# EAGLE design Adafruit 2.9in eInk FeatherWing (EAGLE 9.6.2)
COMPANY: ADAFRUIT INDUSTRIES; DRAWN: K. TOWNSEND; REV: A
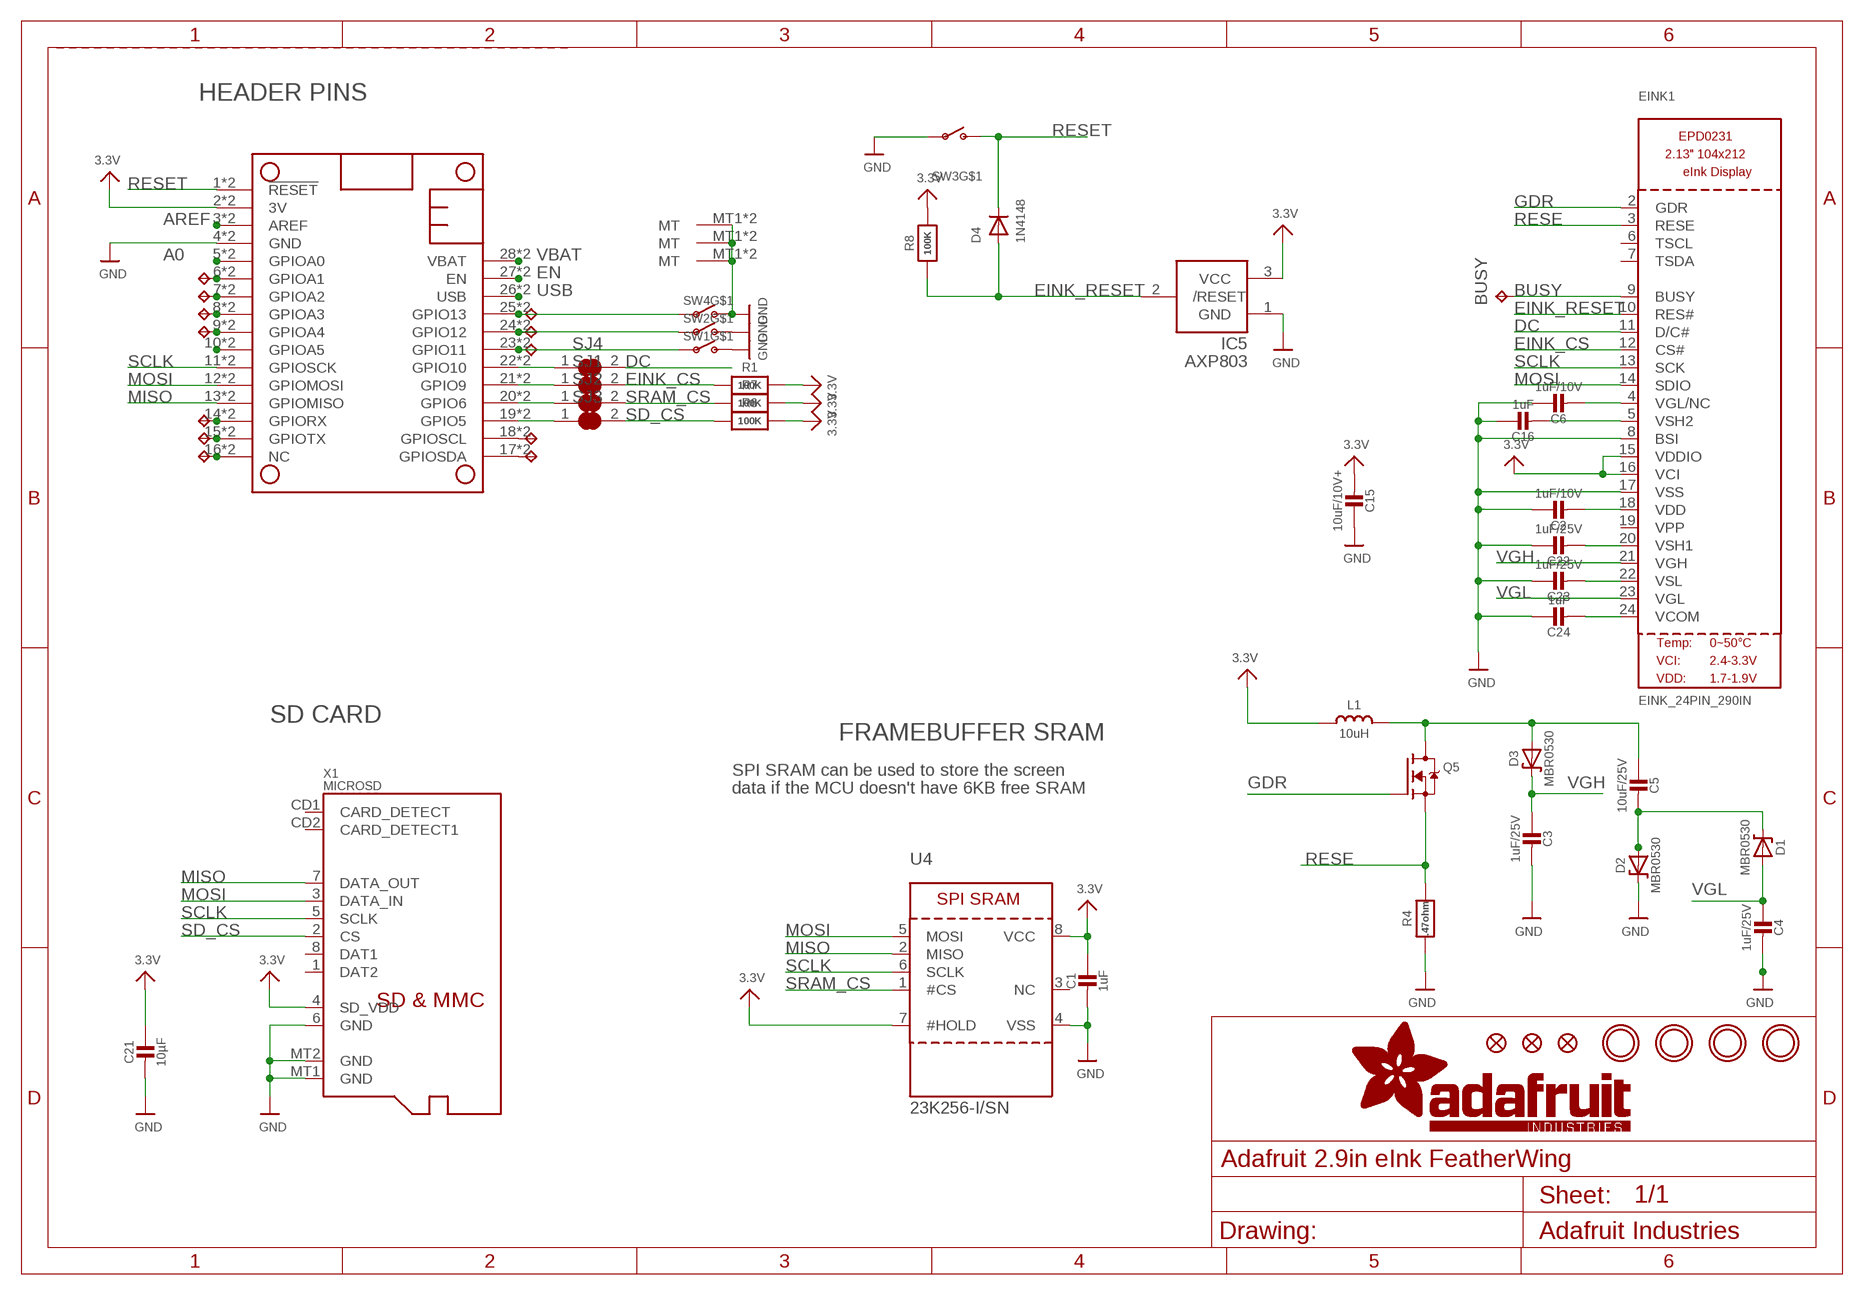
[diagram p0: schematic, sheet 1]

## Parts
BUSY  TPTP15SQ  [TP15SQ]
C1  1uF  CAP_CERAMIC0805_10MGAP  [0805_10MGAP]
C2  1uF/10V  CAP_CERAMIC0805-NOOUTLINE  [0805-NO]
C3  1uF/25V  CAP_CERAMIC0805-NOOUTLINE  [0805-NO]
C4  1uF/25V  CAP_CERAMIC0805-NOOUTLINE  [0805-NO]
C5  10uF/25V  CAP_CERAMIC0805-NOOUTLINE  [0805-NO]
C6  1uF/10V  CAP_CERAMIC0805-NOOUTLINE  [0805-NO]
C15  10uF/10V+  CAP_CERAMIC0805-NOOUTLINE  [0805-NO]
C16  1uF  CAP_CERAMIC0805-NOOUTLINE  [0805-NO]
C21  10µF  CAP_CERAMIC0805-NOOUTLINE  [0805-NO]
C22  1uF/25V  CAP_CERAMIC0805-NOOUTLINE  [0805-NO]
C23  1uF/25V  CAP_CERAMIC0805-NOOUTLINE  [0805-NO]
C24  1uF  CAP_CERAMIC0805-NOOUTLINE  [0805-NO]
D1  MBR0530  DIODE-SCHOTTKYSOD-123  [SOD-123]
D2  MBR0530  DIODE-SCHOTTKYSOD-123  [SOD-123]
D3  MBR0530  DIODE-SCHOTTKYSOD-123  [SOD-123]
D4  1N4148  DIODESOD-323F  [SOD-323F]
EINK1  EINK_24PIN_290IN  [EINK_290IN]
FID1  FIDUCIAL_1MM  [FIDUCIAL_1MM]
FID2  FIDUCIAL_1MM  [FIDUCIAL_1MM]
FID3  FIDUCIAL_1MM  [FIDUCIAL_1MM]
IC5  AXP803  AXP083-SAG  [SOT23]
L1  10uH  INDUCTORNR401  [INDUCTOR_4X4MM_NR401]
MS1  FEATHERWING_SMTDUALNOHOLES  [FEATHERWING_SMT_NOHOLES]
Q5  IRLML0100  IRLML2060TRPBF  [SOT23-3]
R1  100K  RESISTOR_0603_NOOUT  [0603-NO]
R4  .47ohm  RESISTOR0805_10MGAP  [0805_10MGAP]
R6  100K  RESISTOR_0603_NOOUT  [0603-NO]
R7  100K  RESISTOR_0603_NOOUT  [0603-NO]
R8  100K  RESISTOR_0603_NOOUT  [0603-NO]
SJ1  SOLDERJUMPER_CLOSED  [SOLDERJUMPER_CLOSEDWIRE]
SJ2  SOLDERJUMPER_CLOSED  [SOLDERJUMPER_CLOSEDWIRE]
SJ3  SOLDERJUMPER_CLOSED  [SOLDERJUMPER_CLOSEDWIRE]
SJ4  SOLDERJUMPER_CLOSED  [SOLDERJUMPER_CLOSEDWIRE]
SW1  SWITCH_SPST_TACT_RA  [SPST_TACTILE_RA]
SW2  SWITCH_SPST_TACT_RA  [SPST_TACTILE_RA]
SW3  SWITCH_SPST_TACT_RA  [SPST_TACTILE_RA]
SW4  SWITCH_SPST_TACT_RA  [SPST_TACTILE_RA]
TP1  TPTP15SQ  [TP15SQ]
TP2  TPTP15SQ  [TP15SQ]
TP3  TPTP15SQ  [TP15SQ]
TP4  TPTP15SQ  [TP15SQ]
TP5  TPTP15SQ  [TP15SQ]
TP6  TPTP15SQ  [TP15SQ]
TP7  TPTP15SQ  [TP15SQ]
TP8  TPTP15SQ  [TP15SQ]
TP9  TPTP15SQ  [TP15SQ]
TP11  TPTP15SQ  [TP15SQ]
TP12  TPTP15SQ  [TP15SQ]
TP13  TPTP15SQ  [TP15SQ]
U4  23K256-I/SN  SRAM_SPI_SOIC8  [SOIC8_150MIL]
U$3  MOUNTINGHOLE2.5  [MOUNTINGHOLE_2.5_PLATED]
U$4  MOUNTINGHOLE2.5  [MOUNTINGHOLE_2.5_PLATED]
U$5  MOUNTINGHOLE2.5  [MOUNTINGHOLE_2.5_PLATED]
U$6  MOUNTINGHOLE2.5  [MOUNTINGHOLE_2.5_PLATED]
X1  MICROSD  [MICROSD]

## Nets
3.3V: C1.1 C15.2 C21.1 EINK1.15(VDDIO) EINK1.16(VCI) IC5.3(VCC) L1.P$2 MS1.2(3V) MS1.2B(3V) R1.2 R6.2 R7.2 R8.2 U4.7(#HOLD) U4.8(VCC) X1.4(SD_VDD)
A0: MS1.5(GPIOA0) MS1.5B(GPIOA0)
AREF: MS1.3(AREF) MS1.3B(AREF)
BUSY: BUSY.TP EINK1.9(BUSY)
DC: EINK1.11(D/C#) SJ4.2
EINK_CS: EINK1.12(CS#) R1.1 SJ1.2
EINK_RESET: D4.A EINK1.10(RES#) IC5.2(/RESET) R8.1
EN: MS1.27(EN) MS1.27B(EN)
GDR: EINK1.2(GDR) Q5.1(G)
GND: C1.2 C2.1 C3.2 C4.2 C6.1 C15.1 C16.1 C21.2 C22.1 C23.1 C24.1 D2.C EINK1.8(BSI) EINK1.17(VSS) IC5.1(GND) MS1.4(GND) MS1.4B(GND) R4.2 SW1.2(S) SW1.MT1(MT) SW1.MT2(MT) SW2.2(S) SW2.MT1(MT) SW2.MT2(MT) SW3.1(P) SW4.2(S) SW4.MT1(MT) SW4.MT2(MT) U4.4(VSS) X1.6(GND) X1.MT1(GND) X1.MT2(GND)
H: MS1.19(GPIO5) MS1.19B(GPIO5) SJ3.1
I: MS1.20(GPIO6) MS1.20B(GPIO6) SJ2.1
J: MS1.21(GPIO9) MS1.21B(GPIO9) SJ1.1
K: MS1.22(GPIO10) MS1.22B(GPIO10) SJ4.1
MISO: MS1.13(GPIOMISO) MS1.13B(GPIOMISO) U4.2(MISO) X1.7(DATA_OUT)
MOSI: EINK1.14(SDIO) MS1.12(GPIOMOSI) MS1.12B(GPIOMOSI) U4.5(MOSI) X1.3(DATA_IN)
N$1: MS1.10(GPIOA5) MS1.10B(GPIOA5)
N$2: C5.2 D1.C D2.A
N$3: C5.1 D3.A L1.P$1 Q5.3(D)
N$4: C16.2 EINK1.5(VSH2)
N$5: C2.2 EINK1.18(VDD)
N$6: C22.2 EINK1.20(VSH1)
N$8: MS1.6(GPIOA1) MS1.6B(GPIOA1) TP6.TP
N$9: C6.2 EINK1.4(VGL/NC)
N$10: MS1.7(GPIOA2) MS1.7B(GPIOA2) TP7.TP
N$11: MS1.8(GPIOA3) MS1.8B(GPIOA3) TP8.TP
N$12: MS1.9(GPIOA4) MS1.9B(GPIOA4) TP9.TP
N$14: MS1.14(GPIORX) MS1.14B(GPIORX) TP11.TP
N$15: MS1.15(GPIOTX) MS1.15B(GPIOTX) TP12.TP
N$16: MS1.16(NC) MS1.16B(NC) TP13.TP
N$17: MS1.17(GPIOSDA) MS1.17B(GPIOSDA) TP4.TP
N$18: MS1.18(GPIOSCL) MS1.18B(GPIOSCL) TP3.TP
N$19: MS1.23(GPIO11) MS1.23B(GPIO11) SW1.1(P) TP1.TP
N$20: MS1.24(GPIO12) MS1.24B(GPIO12) SW2.1(P) TP2.TP
N$21: MS1.25(GPIO13) MS1.25B(GPIO13) SW4.1(P) TP5.TP
N$27: C23.2 EINK1.22(VSL)
N$33: C24.2 EINK1.24(VCOM)
RESE: EINK1.3(RESE) Q5.2(S) R4.1
RESET: D4.C MS1.1(!RESET) MS1.1B(!RESET) SW3.2(S)
SCLK: EINK1.13(SCK) MS1.11(GPIOSCK) MS1.11B(GPIOSCK) U4.6(SCLK) X1.5(SCLK)
SD_CS: R6.1 SJ3.2 X1.2(CS)
SRAM_CS: R7.1 SJ2.2 U4.1(#CS)
USB: MS1.26(USB) MS1.26B(USB)
VBAT: MS1.28(VBAT) MS1.28B(VBAT)
VGH: C3.1 D3.C EINK1.21(VGH)
VGL: C4.1 D1.A EINK1.23(VGL)
Unconnected: EINK1.6(TSCL) EINK1.7(TSDA) EINK1.19(VPP) SW3.MT1(MT) SW3.MT2(MT) U4.3(NC) X1.1(DAT2) X1.8(DAT1) X1.CD1(CARD_DETECT) X1.CD2(CARD_DETECT1)

## Notes on the sheet
- HEADER PINS
- SD CARD
- FRAMEBUFFER SRAM
- SPI SRAM can be used to store the screen
- data if the MCU doesn't have 6KB free SRAM

## Library data of the parts
BUSY TP1-TP9 TP11-TP13 = testpad:TP: Test pad
C1 = microbuilder:CAP_CERAMIC: Ceramic Capacitors For new designs, use the packages preceded by an '_' character since they are more reliable: The following footprints should be used on most boards: _0402 - Standard footprint for regular board layouts _0603 - Standard footprint for regular board layouts _0805 - Standard footprint for regular board layouts _1206 - Standard footprint for regular board layouts For extremely tight-pitch boards where space is at a premium, the following 'micro-pitch' footprints can be used (smaller pads, no silkscreen outline, etc.): _0402MP - Micro-pitch footprint for very dense/compact boards _0603MP - Micro-pitch footprint for very dense/compact boards _0805MP - Micro-pitch footprint for very dense/compact boards _1206MP - Micro-pitch footprint for very dense/compact boards; REV: A
C2-C6 C15 C16 C21-C24 = microbuilder:CAP_CERAMIC: Ceramic Capacitors For new designs, use the packages preceded by an '_' character since they are more reliable: The following footprints should be used on most boards: _0402 - Standard footprint for regular board layouts _0603 - Standard footprint for regular board layouts _0805 - Standard footprint for regular board layouts _1206 - Standard footprint for regular board layouts For extremely tight-pitch boards where space is at a premium, the following 'micro-pitch' footprints can be used (smaller pads, no silkscreen outline, etc.): _0402MP - Micro-pitch footprint for very dense/compact boards _0603MP - Micro-pitch footprint for very dense/compact boards _0805MP - Micro-pitch footprint for very dense/compact boards _1206MP - Micro-pitch footprint for very dense/compact boards
D1-D3 = microbuilder:DIODE-SCHOTTKY
D4 = adafruit:DIODE: Diode SMADIODE - SMA Surface Mount Package 20V 1A Schottky Diode Digikey: 641-1014-6-ND DO-1N4148 - Through Hole Small Current Diode SOD-123 20V 1 A (.5mV Vf) Schottky Diode - Digikey: MBRX120TPMSCT-ND SOD-323 10V 570mA (.38mV Vf, 3ns) Schottky Diode - Digikey: ZLLS410CT-ND SOD-523 30V 30mA Schottky Diode (RB751S-40TE61) - Digikey: RB751S-40TE61CT-ND SOT23-R/W - SOT23 Package (R = Solder Paste/Reflow Ovens, W = Hand-Soldering) BAT54Film 40V 300mA - Digikey: 497-7162-1-ND
EINK1 = adafruit_display:EINK_24PIN
FID1-FID3 = microbuilder:FIDUCIAL: Fiducial Alignment Points Various fiducial points for machine vision alignment.; BOM: EXCLUDE
IC5 = adafruit:AXP083
L1 = microbuilder:INDUCTOR: Inductors 0603: 10nH Ceramic Inductor - microwire antenna/RF (Digikey: 712-1434-2-ND) 0805: 560nH Ceramic Inductor - RF (Digikey: 553-1047-1-ND) 270nH Ceramic Inductor - Q = 40@250MHz, +-5%, 1 Ohm DC Resistance (Digikey: 535-10506-2-ND) 1007 (2518 Metric) SMT: 10µH 10% 250mOhm 820mA 1007 Inductor (Digikey: 587-2189-1-ND) 22µH 10% 500mOhm 580mA 1007 Inductor (Digikey: 587-2190-1-ND) 47µH 10% 950mOhm 420mA 1007 Inductor (Digikey: 587-2191-1-ND) 47µH 5% 100mOhm 1A 1008 Inductor (Digikey: 732-1816-1-ND) 5.0x5.0mm (Taiyo Yuden NR5040 Series) 6.8µH 20% 2.3A 64mOhm Inductor (Digikey: 587-2374-2-ND) 5.0x5.0mm (TDK VLC5045 Series) 4.7µH 20% 3.3A 34mOhm Inductor (Digikey: 445-6526-1-ND) 6.8µH 20% 2.7A 46mOhm Inductor (Digikey: 445-6527-1-ND) 6.0x6.0mm (TDK VLC6045 Series) 4.7µH 20% 3.8A 27mOhm Inductor (Digikey: 445-6538-2-ND) 6.8µH 20% 3A 41mOhm Inductor (Digikey: 445-6540-1-ND) 6.2µH 30% 2.2A 45mOhm Inductor (Digikey: SRR5028-6R2YCT-ND) - Not TDK VLC6045 but footprint should match 6.0x6.0mm (TDK SLF6045 Series) 6.8uH 30% 2A 33mOhm Inductor (Digikey: 445-4572-1-ND, Mouser: 810-SLF645T6R8N2R0PF) 6.0x6.0mm (Sumida CDRH5D28 Series) 6.2uH 30% 1.8A 45mOhm Inductor (Digikey: 308-1542-1-ND) Taiyo Yuden NR3015T2R2M - 2.2uH 20% 1.5A (Digikey: 587-1648-2-ND, Mouser: 963-NR3015T2R2M) - Used with TI TPS62172 CoilCraft RFID Transponder Coil - MA5532-AE (For use with AS3935 Lightning Sensor) Taiyo Yuden NRH2412T2R2MNGH - 2.2uH 20% 1AA (Digikey: 587-3443-1-ND) - Used with TI LM3671 Vishay IHLP 1.0uH Molded Inductor - 24mOhm DCR, 5A, +/-20%, -55°C-125°C (Digikey: 541-1319-1-ND)
MS1 = microbuilder:FEATHERWING
Q5 = Parts:IRLML2060TRPBF
R1 R4 R6-R8 = microbuilder:RESISTOR: Resistors For new designs, use the packages preceded by an '_' character since they are more reliable: The following footprints should be used on most boards: _0402 - Standard footprint for regular board layouts _0603 - Standard footprint for regular board layouts _0805 - Standard footprint for regular board layouts _1206 - Standard footprint for regular board layouts For extremely tight-pitch boards where space is at a premium, the following 'micro-pitch' footprints can be used (smaller pads, no silkscreen outline, etc.): _0402MP - Micro-pitch footprint for very dense/compact boards _0603MP - Micro-pitch footprint for very dense/compact boards _0805MP - Micro-pitch footprint for very dense/compact boards _1206MP - Micro-pitch footprint for very dense/compact boards
SJ1-SJ4 = microbuilder:SOLDERJUMPER_CLOSED: Solder Jumper - Closed These solder jumpers are closed by default CLOSEDWIRE - 10 mil trace between pads that can be cut and resoldered later CLOSEDPERM - 63 mil trace between pads for a permanent connection (used to 'bridge' two signals, a shameless hack for Eagle). Can double as a test point as well (no cream layer)
SW1-SW4 = microbuilder:SWITCH_SPST: Switch - SPST 4UCon 19192 (6.7x2.6mm SMT)
U4 = microbuilder:SRAM_SPI_SOIC8: SRAM - 8-Pin SPI Interface 23K640-I/SN - 8KB (64Kb), 20MHz, 2.7-3.6V 23K256-I/SN - 32KB (256Kb), 20MHz, 2.7-3.6V 23LC512-I/SN - 64KB (512Kb), 20MHz, 2.7-3.6V
U$3-U$6 = microbuilder:MOUNTINGHOLE: Mounting Hole For #2 screws (0.086"/2.18mm width, 0.094"/2.4mm hole) use 2.5mm; BOM: EXCLUDE
X1 = microbuilder:MICROSD: MicroSD/Transflash Card Holder with SPI pinout 3M: 2908-05WB-MG 4UConnector: 19656 Footprint courtesy: Adafruit Industries

## Board
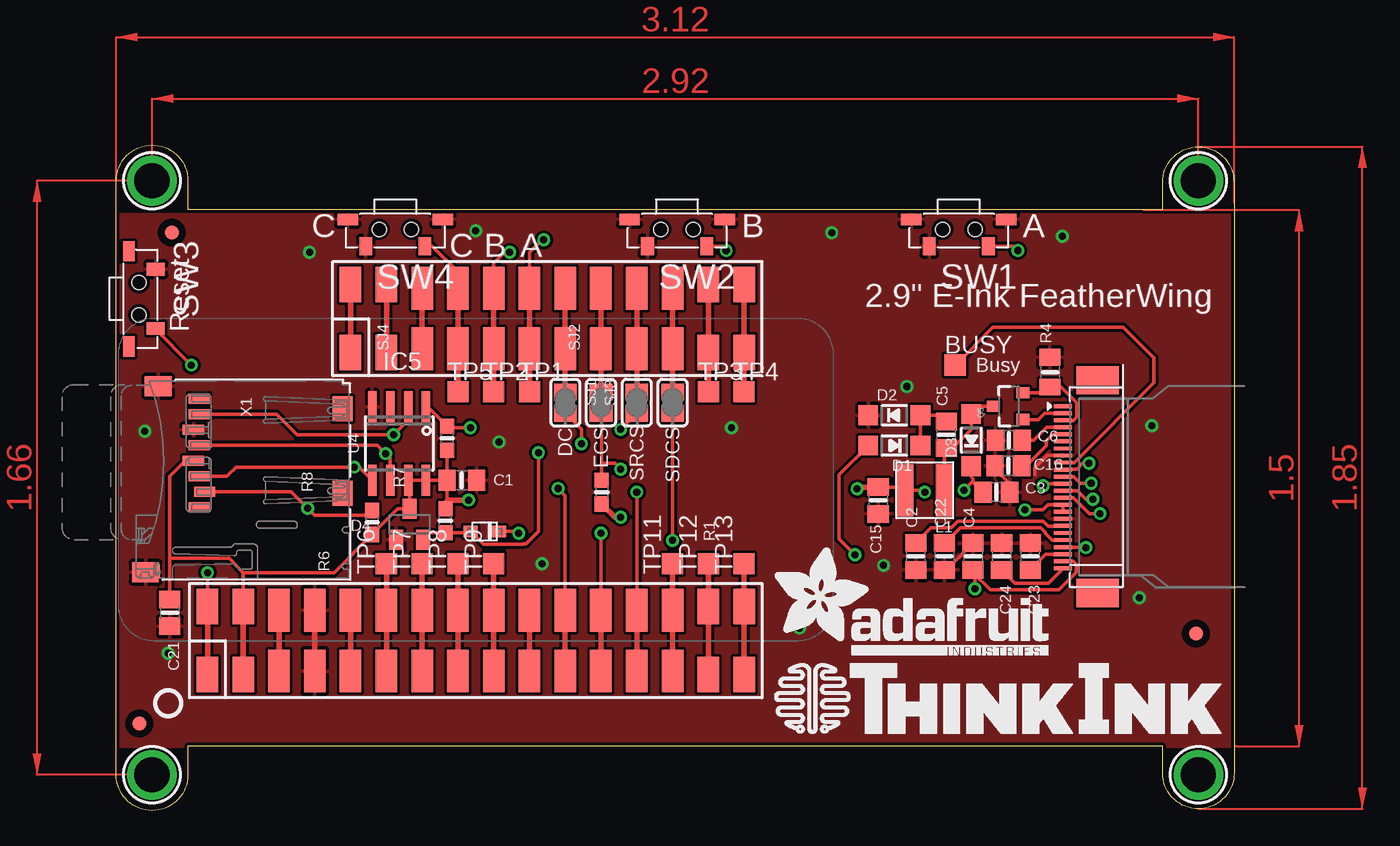
[diagram p1: board, top side]
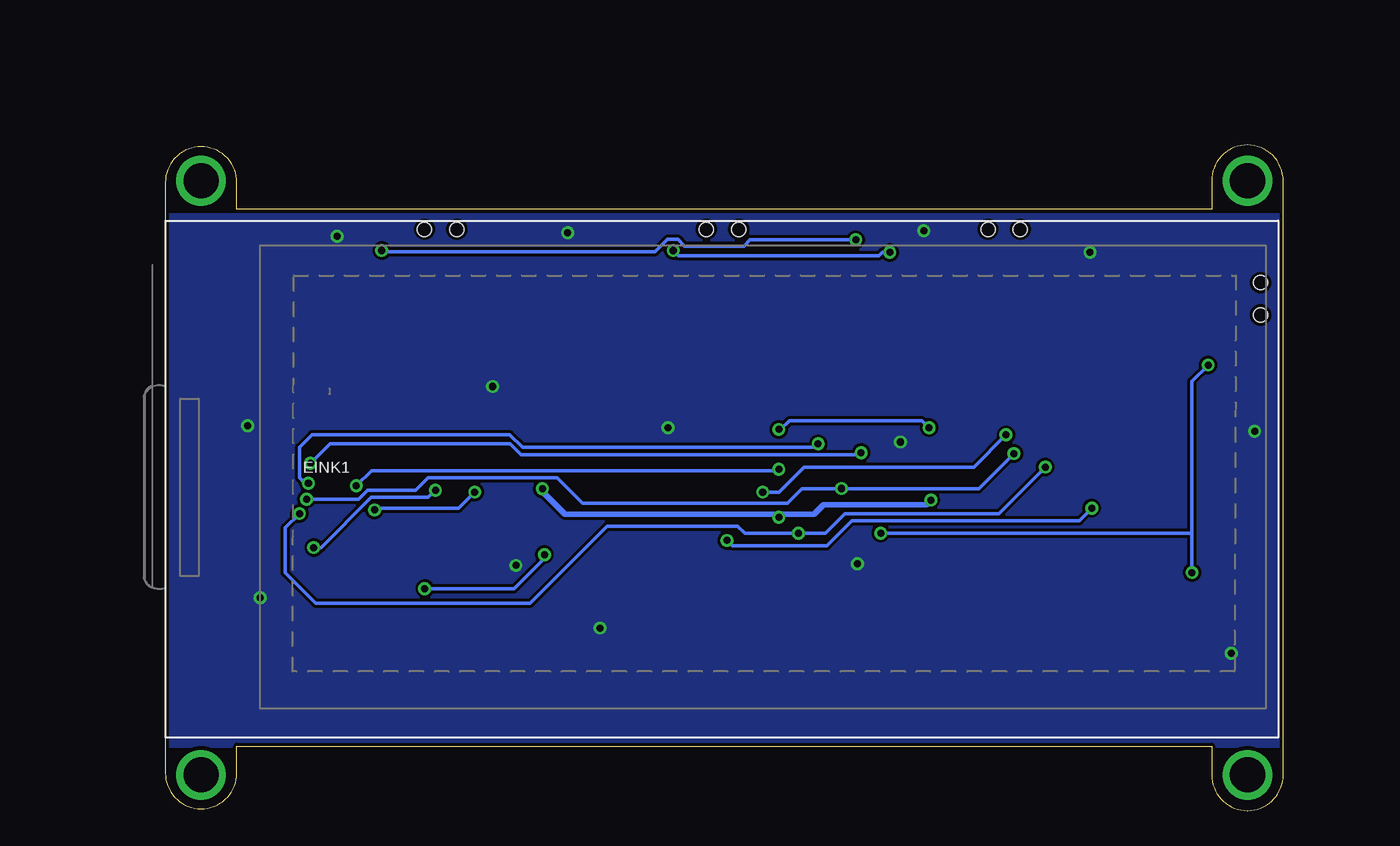
[diagram p2: board, bottom side, seen from below]

Size 79.38 x 47.24 mm. Coordinates in mm from the lower left corner, seen from the top.
Outline: 76.83,0.13 arc-90 74.3,2.67 74.3,4.57 5.08,4.57 5.08,2.54 arc-90 2.54,0 2.53,0 arc-90 0,2.54 0,44.7 arc-90 2.54,47.24 2.54,47.24 arc-90 5.08,44.7 5.08,42.67 74.3,42.67 74.3,44.58 arc-90 76.83,47.12 arc-90 79.38,44.58 79.38,2.67 arc-90 76.83,0.13
Copper layers (1*16): Top 0.035mm / dielectric 1.5mm / Bottom 0.035mm
Design rules "adafruit *": minimum track width 8mil, minimum drill 15.5mil, track to track 8mil, track to pad 8mil, pad to pad 8mil, via to via 8mil, smd to smd 8mil, copper to edge 10mil, drill to drill 8mil, minimum pad ring 10mil, minimum via ring 8mil, stop-mask expansion 2mil, vias tented up to drill 20mil, thermal gap 10mil

### Footprints (pad centres in the part's own frame; a part is rotated, then mirrored left to right if it is on the bottom)
TP15SQ = smd 1.5 x 1.5: TP 0,0
0805_10MGAP = smd 1.2 x 1.5: 1 -1.05,0; 2 1.05,0
0805-NO = smd 1.24 x 1.5: 1 -0.95,0; 2 0.95,0
SOD-123 = smd 1.4 x 1.4: A 1.85,0; C -1.85,0
SOD-323F = smd 1 x 0.8: A -1,0; C 1,0
EINK_290IN = smd 1.25 x 0.275 bottom: 1 2.51,5.208; 2 2.51,4.708; 3 2.51,4.208; 4 2.51,3.708; 5 2.51,3.208; 6 2.51,2.708; 7 2.51,2.208; 8 2.51,1.708; 9 2.51,1.208; 10 2.51,0.708; 11 2.51,0.208; 12 2.51,-0.292; 13 2.51,-0.792; 14 2.51,-1.292; 15 2.51,-1.792; 16 2.51,-2.292; 17 2.51,-2.792; 18 2.51,-3.292; 19 2.51,-3.792; 20 2.51,-4.292; 21 2.51,-4.792; 22 2.51,-5.292; 23 2.51,-5.792; 24 2.51,-6.292 | smd 3 x 2 bottom: SPRT1 0.05,7.058; SPRT2 0.05,-8.052
FIDUCIAL_1MM = smd 1 x 1: 1 0,0
SOT23 = smd 1 x 1.4: 1 -0.95,-1.1; 2 0.95,-1.1; 3 0,1.1
INDUCTOR_4X4MM_NR401 = smd 1.2 x 3.7: P$1 -1.4,0; P$2 1.4,0
FEATHERWING_SMT_NOHOLES = smd 1.524 x 2.54: 1 6.35,2.413; 1B 6.35,-2.413; 2 8.89,2.413; 2B 8.89,-2.413; 15 41.91,2.413; 15B 41.91,-2.413; 16 44.45,2.413; 16B 44.45,-2.413; 17 44.45,20.447; 17B 44.45,25.273; 18 41.91,20.447; 18B 41.91,25.273; 27 19.05,20.447; 27B 19.05,25.273; 28 16.51,20.447; 28B 16.51,25.273 | smd 1.524 x 3.048: 3 11.43,2.159; 3B 11.43,-2.159; 4 13.97,2.159; 4B 13.97,-2.159; 5 16.51,2.159; 5B 16.51,-2.159; 6 19.05,2.159; 6B 19.05,-2.159; 7 21.59,2.159; 7B 21.59,-2.159; 8 24.13,2.159; 8B 24.13,-2.159; 9 26.67,2.159; 9B 26.67,-2.159; 10 29.21,2.159; 10B 29.21,-2.159; 11 31.75,2.159; 11B 31.75,-2.159; 12 34.29,2.159; 12B 34.29,-2.159; 13 36.83,2.159; 13B 36.83,-2.159; 14 39.37,2.159; 14B 39.37,-2.159; 19 39.37,20.701; 19B 39.37,25.019; 20 36.83,20.701; 20B 36.83,25.019; 21 34.29,20.701; 21B 34.29,25.019; 22 31.75,20.701; 22B 31.75,25.019; 23 29.21,20.701; 23B 29.21,25.019; 24 26.67,20.701; 24B 26.67,25.019; 25 24.13,20.701; 25B 24.13,25.019; 26 21.59,20.701; 26B 21.59,25.019
SOT23-3 = smd 0.8 x 0.9: 1 -0.95,-1; 2 0.95,-1; 3 0,1.1
0603-NO = smd 1.075 x 1: 1 -0.85,0; 2 0.85,0
SOLDERJUMPER_CLOSEDWIRE = smd 1.168 x 1.6: 1 -0.762,0; 2 0.762,0 | smd 0.635 x 0.203: WIRE 0,0
SPST_TACTILE_RA = smd 0.9 x 1.27: 1 -2.1,0.9; 2 2.1,0.9 | smd 1.45 x 0.8: MT1 -3.375,-1; MT2 3.375,-1 | hole 1: -1.15,-0.3; 1.15,-0.3
SOIC8_150MIL = smd 0.6 x 2.2: 1 -1.905,-2.6; 2 -0.635,-2.6; 3 0.635,-2.6; 4 1.905,-2.6; 5 1.905,2.6; 6 0.635,2.6; 7 -0.635,2.6; 8 -1.905,2.6
MOUNTINGHOLE_2.5_PLATED = drill 2.5 pad 3.2: P$1 0,0
MICROSD = smd 0.7 x 1.5: 1 9,-10.64; 2 7.9,-10.24; 3 6.8,-10.64; 4 5.7,-11.04; 5 4.6,-10.64; 6 3.5,-11.04; 7 2.4,-10.64; 8 1.3,-10.64 | smd 1.8 x 1.4: CD1 2,-0.44; CD2 8,-0.44 | smd 1.4 x 1.9: MT1 0.4,-13.54; MT2 13.6,-14.44

### Placement (x,y rotation side)
BUSY  59.56,31.62 0 top
C1  24.53,23.44 0 top
C2  56.77,18.03 90 top
C3  62.48,22.61 0 top
C4  60.83,18.03 90 top
C5  58.93,26.67 90 top
C6  63.37,26.29 0 top
C15  54.1,22.01 90 top
C16  63.33,24.47 0 top
C21  3.8,14.05 270 top
C22  58.8,18.03 90 top
C23  64.9,18.03 270 top
C24  62.87,18.03 270 top
D1  55.24,25.91 180 top
D2  55.24,28.07 0 top
D3  60.71,26.29 90 top
D4  26.16,19.81 0 top
EINK1  69.72,23.49 0 bottom
FID1  76.66,12.57 0 top
FID2  1.64,6.17 90 top
FID3  3.94,41.02 0 top
IC5  20.83,20.32 0 top
L1  57.4,22.73 180 top
MS1  0.13,12.07 0 top
Q5  63.37,28.7 90 top
R1  34.47,22.61 270 top
R4  66.29,31.11 90 top
R6  18.16,20.45 270 top
R7  23.5,26.42 270 top
R8  23.37,20.57 90 top
SJ1  34.42,28.96 270 top
SJ2  36.96,28.96 270 top
SJ3  39.5,28.96 270 top
SJ4  31.88,28.96 270 top
SW1  59.82,40.96 180 top
SW2  39.81,40.96 180 top
SW3  1.91,36.32 270 top
SW4  19.81,40.96 180 top
TP1  29.34,29.72 0 top
TP2  26.8,29.72 0 top
TP3  42.04,29.72 0 top
TP4  44.58,29.72 0 top
TP5  24.26,29.72 0 top
TP6  19.18,17.53 90 top
TP7  21.72,17.53 90 top
TP8  24.26,17.53 90 top
TP9  26.8,17.53 90 top
TP11  39.5,17.53 90 top
TP12  42.04,17.53 90 top
TP13  44.58,17.53 90 top
U4  20.09,26.05 180 top
U$3  76.83,2.54 0 top
U$4  2.54,2.54 0 top
U$5  76.83,44.7 0 top
U$6  2.54,44.7 0 top
U$8  [THINKINK_1.25IN]  46.74,5.46 0 top
U$9  [PCBFEAT-REV-040]  3.68,7.62 0 top
U$17  [ADAFRUIT_TEXT_20MM]  46.61,11.05 0 top
X1  16.52,30.52 270 top

### Tracks (layer width: path | path; a pad name or v marks a point on that pad's centre or on a via)
3.3V  (via drill 0.5)
  Top 0.254: EINK1.16 EINK1.15 66.15,21.7 65.79,21.34 v64.52,21.34 | C15.2 54.48,22.96 55.78,22.96 L1.P$2 57.28,22.73 v57.4,22.61 | R7.2 23.5,23.46 C1.1 | C1.1 22,23.44 U4.8 U4.7 20.83,23.35 IC5.3 19.98,21.42 R6.2 15.46,16.89 9.02,16.89 | C1.1 23.48,21.97 23.48,21.54 R8.2 | C21.1 3.8,17.91 | 3.8,17.91 3.8,23.74 4.88,24.82 X1.4 | MS1.2 9.02,16.89 | 3.8,17.91 8,17.91 9.02,16.89
  Top 0.406: MS1.2 MS1.2B | R1.2 35.4,20.83 v35.81,20.83 | v52.6,22.84 52.72,22.96 54.48,22.96 | v25.02,22.04 23.55,22.04 23.48,21.97
  Bottom 0.254: v57.4,22.61 58.55,21.46 64.26,21.46 64.39,21.34 v64.52,21.34
  Bottom 0.406: v35.81,20.83 36.02,21.04 | 36.02,21.04 51,21.04 52.6,22.63 v52.6,22.84 | 36.02,21.04 33.32,21.04 32.64,21.72 25.34,21.72 v25.02,22.04
A0
  Top 0.406: MS1.5B MS1.5
AREF
  Top 0.406: MS1.3B MS1.3
BUSY
  Top 0.254: BUSY.TP 62.23,34.29 71.5,34.29 73.66,32.13 73.66,30.35 68.01,24.7 EINK1.9
DC  (via drill 0.5)
  Top 0.254: SJ4.2 33.02,27.05 v33.02,26.04 | v69.22,23.24 68.45,23.24 67.99,23.7 EINK1.11
  Bottom 0.254: v33.02,26.04 33.27,25.78 54.01,25.78 54.92,26.69 68.94,26.69 69.85,25.78 69.85,23.62 69.47,23.24 v69.22,23.24
EINK_CS  (via drill 0.5)
  Top 0.254: R1.1 34.47,24.64 | SJ1.2 34.47,28.14 34.47,24.64 | v35.81,24.24 35.41,24.64 34.47,24.64 | v65.81,23.05 65.81,23.2 EINK1.12
  Bottom 0.254: v35.81,24.24 35.92,24.13 64.73,24.13 v65.81,23.05
EINK_RESET  (via drill 0.5)
  Top 0.254: IC5.2 22.28,19.72 R8.1 25.07,19.72 D4.A 26.07,18.9 28.9,18.9 28.92,18.92 29.08,18.92 29.97,19.81 v29.97,25.4 | EINK1.10 67.25,24.23 68.19,24.23 68.61,24.65 v69.07,24.65
  Bottom 0.254: v69.07,24.65 67.68,26.04 54.91,26.04 54.13,25.25 30.12,25.25 v29.97,25.4
EN
  Top 0.406: MS1.27 MS1.27B
GDR
  Top 0.254: EINK1.2 65.92,28.2 65.47,27.75 Q5.1
GND  (via drill 0.5)
  Top 0.254: C16.1 62.38,24.23 63.43,23.18 C3.2 | EINK1.8 66.1,25.2 65.23,24.34 65.23,23.83 | C4.2 58.93,17.08 C22.1
  Top 0.406: MS1.4 MS1.4B
  other vias: 2.03,26.92 30.23,17.53 27.18,26.16 43.69,27.18 56.13,30.1 73.53,27.3 72.64,15.11 54.48,17.4 48.51,12.95 50.8,41.02 25.53,41.15 67.18,40.77 13.72,39.62 3.68,11.18
  pour Bottom: 0.13,42.29 79.5,42.29 79.5,4.57 0.13,4.57
  pour Top: 0.13,42.29 79.5,42.29 79.5,4.57 0.13,4.57
H
  Top 0.406: MS1.19B MS1.19 SJ3.1
I
  Top 0.406: MS1.20B MS1.20 SJ2.1
J
  Top 0.406: MS1.21B MS1.21 SJ1.1
K
  Top 0.406: MS1.22B MS1.22 SJ4.1
MISO  (via drill 0.5)
  Top 0.254: X1.7 11.38,28.12 12.83,26.67 v19.68,26.67 20.72,27.71 U4.2 | MS1.13 v36.96,22.61
  Top 0.406: MS1.13 MS1.13B
  Bottom 0.254: v36.96,22.61 35.81,22.61 34.04,24.38 21.97,24.38 v19.68,26.67
MOSI  (via drill 0.5)
  Top 0.254: X1.3 7.84,23.72 8.51,24.38 v16.89,24.38 17.25,24.38 U4.5 | v34.42,19.68 MS1.12 | v69.85,21.08 69.09,21.08 67.97,22.2 EINK1.14
  Top 0.406: MS1.12B MS1.12
  Bottom 0.254: v16.89,24.38 20.19,21.08 31.11,21.08 32.51,19.68 v34.42,19.68 38.23,19.68 38.73,20.19 48.01,20.19 53.47,14.73 68.71,14.73 70.87,16.89 70.87,20.07 v69.85,21.08
N$1
  Top 0.406: MS1.10B MS1.10
N$2
  Top 0.254: C5.2 58.48,28.07 D2.A D1.C
N$3
  Top 0.254: Q5.3 61.27,28.7 D3.A 60.71,27.05 59.38,25.72 C5.1 58.8,25.6 L1.P$1
N$4
  Top 0.254: EINK1.5 67.18,26.67 66.45,26.67 66.04,26.26 66.04,25.91 64.52,24.38 64.38,24.38 C16.2
N$5
  Top 0.254: C2.2 57.85,20.07 59.3,20.07 59.76,20.52 65.84,20.52 66.17,20.2 EINK1.18
N$6
  Top 0.254: EINK1.20 66.46,19.2 65.98,19.68 65.98,19.74 65.65,20.07 59.94,20.07 58.86,18.98 C22.2
N$8
  Top 0.406: MS1.6B MS1.6 TP6.TP
N$9
  Top 0.254: EINK1.4 66.06,27.2 65.15,26.29 C6.2
N$10
  Top 0.406: MS1.7B MS1.7 TP7.TP
N$11
  Top 0.406: MS1.8B MS1.8 TP8.TP
N$12
  Top 0.406: MS1.9B MS1.9 TP9.TP
N$14
  Top 0.406: MS1.14B MS1.14 TP11.TP
N$15
  Top 0.406: MS1.15B MS1.15 TP12.TP
N$16
  Top 0.406: MS1.16B MS1.16 TP13.TP
N$17
  Top 0.406: MS1.17B MS1.17 TP4.TP
N$18
  Top 0.406: MS1.18B MS1.18 TP3.TP
N$19  (via drill 0.5)
  Top 0.254: MS1.23B 29.34,39.62 30.23,40.51 v30.35,40.51 | v64.01,39.75 63.7,40.06 SW1.1
  Top 0.406: MS1.23B MS1.23 TP1.TP
  Bottom 0.254: v30.35,40.51 37.85,40.51 38.3,40.06 42.51,40.06 42.98,40.53 43.73,40.53 44.59,39.68 63.94,39.68 v64.01,39.75
N$20  (via drill 0.5)
  Top 0.254: MS1.24B 26.8,38.86 27.56,39.62 v27.94,39.62 | v43.31,39.75 43,40.06 SW2.1
  Top 0.406: MS1.24B MS1.24 TP2.TP
  Bottom 0.254: v27.94,39.62 28.45,39.62 28.7,39.37 42.93,39.37 v43.31,39.75
N$21
  Top 0.254: SW4.1 22.43,40.06 24.26,38.23 MS1.25B
  Top 0.406: MS1.25B MS1.25 TP5.TP
N$27
  Top 0.254: EINK1.22 66.02,18.2 C23.2
N$33
  Top 0.254: C24.2 63.82,16.13 66.17,16.13 67.21,17.18 EINK1.24
RESE
  Top 0.254: EINK1.3 67.23,27.69 67.94,27.69 68.2,27.94 68.2,28.95 67.08,30.06 R4.1 65.88,29.65 Q5.2
RESET  (via drill 0.5)
  Top 0.254: MS1.1 v6.48,16.89 | v5.33,31.62 2.81,34.15 SW3.2 | D4.C 28.45,19.81 v28.57,19.68
  Top 0.406: MS1.1B MS1.1
  Bottom 0.254: v6.48,16.89 6.48,19.68 | 6.48,19.68 6.48,30.48 v5.33,31.62 | v28.57,19.68 6.48,19.68
SCLK  (via drill 0.5)
  Top 0.254: X1.5 18.53,25.92 v19.11,25.34 19.45,25 U4.6 | MS1.11 31.88,22.35 v31.37,22.86 | v69.34,22.1 68.83,22.1 68.23,22.7 EINK1.13
  Top 0.406: MS1.11 MS1.11B
  Bottom 0.254: v19.11,25.34 21.59,22.86 v31.37,22.86 34.16,22.86 35.2,21.82 49.76,21.82 51.56,23.62 60.71,23.62 61.59,22.73 65.02,22.73 65.66,22.1 v69.34,22.1
SD_CS  (via drill 0.5)
  Top 0.254: X1.2 12.43,22.62 v13.59,21.46 14.1,20.95 17.82,20.95 R6.1 | v39.5,19.18 SJ3.2
  Bottom 0.254: v13.59,21.46 14.48,20.57 30.61,20.57 32.38,18.8 39.12,18.8 v39.5,19.18
SRAM_CS  (via drill 0.5)
  Top 0.254: U4.1 22.11,28.65 R7.1 23.58,27.18 v25.15,27.18 | v35.81,27.05 SJ2.2
  Bottom 0.254: v25.15,27.18 25.65,27.69 35.05,27.69 35.69,27.05 v35.81,27.05
USB
  Top 0.406: MS1.26 MS1.26B
VBAT
  Top 0.406: MS1.28B 16.64,33.15 16.51,33.02 16.51,32.64 MS1.28
VGH  (via drill 0.5)
  Top 0.254: EINK1.21 68.8,18.7 v68.83,18.67 | D3.C 60.71,23.69 60.83,23.56 60.83,23.37 60.8,23.34 | 60.8,23.34 C3.1 | 60.8,23.34 v60.2,22.73
  Bottom 0.254: v60.2,22.73 60.71,22.22 64.77,22.22 68.33,18.67 v68.83,18.67
VGL  (via drill 0.5)
  Top 0.254: EINK1.23 67.94,17.7 68.17,17.48 68.17,16.93 66.91,15.67 62.06,15.67 60.83,16.9 C4.1 60.96,16.96 v60.96,15.75 | D1.A 51.31,23.82 51.31,19.3 v52.45,18.16
  Bottom 0.254: v60.96,15.75 54.61,15.75 52.45,17.91 v52.45,18.16
(copper drawn outside any net)
  shapes: Top area x5

### Text on the board
tPlace: C | B | A | C | B | A | Reset | 2.9" E-Ink FeatherWing | Busy | DC | ECS | SRCS | SDCS